# EAGLE design maskPlanC-PCB0 (EAGLE 9.6.2)
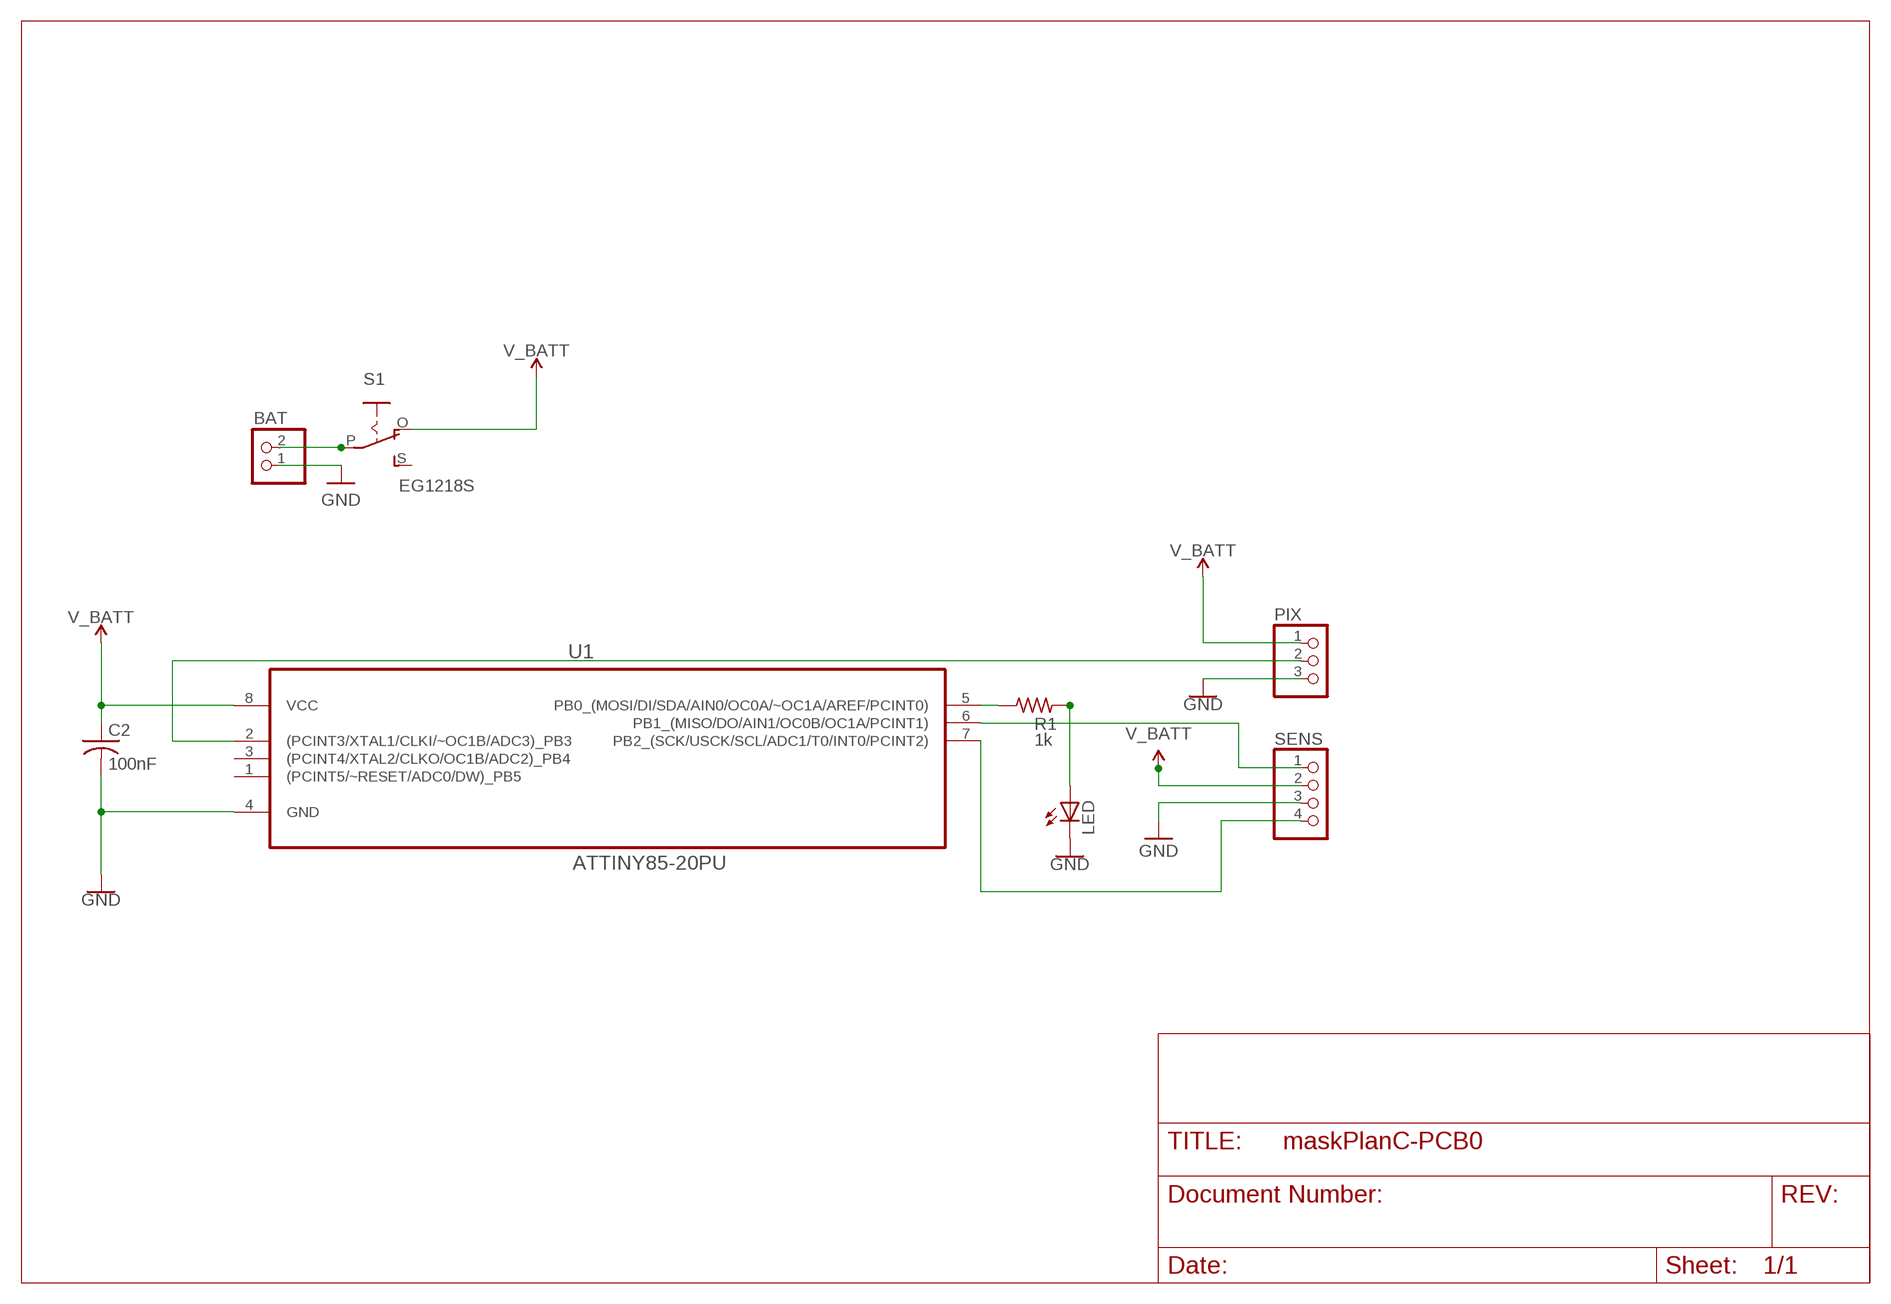
[diagram p0: schematic, sheet 1]

## Parts
BAT  PINHD-1X2  [1X02]
C2  100nF  C-US050-025X075  [C050-025X075]
LED  LED5MM  [LED5MM]
PIX  PINHD-1X3  [1X03]
R1  1k  R-US_0204/7  [0204/7]
S1  EG1218S  [EG1218]
SENS  PINHD-1X4  [1X04]
U1  ATTINY85-20PU  [DIP254P762X533-8]

## Nets
GND: BAT.1 C2.2 LED.K(C) PIX.3 SENS.3 U1.4(GND)
N$1: SENS.1 U1.6(PB1_(MISO/DO/AIN1/OC0B/OC1A/PCINT1))
N$2: LED.A R1.2
N$3: BAT.2 S1.P
N$5: PIX.2 U1.2((PCINT3/XTAL1/CLKI/~OC1B/ADC3)_PB3)
N$6: R1.1 U1.5(PB0_(MOSI/DI/SDA/AIN0/OC0A/~OC1A/AREF/PCINT0))
N$7: SENS.4 U1.7(PB2_(SCK/USCK/SCL/ADC1/T0/INT0/PCINT2))
V_BATT: C2.1 PIX.1 S1.O SENS.2 U1.8(VCC)
Unconnected: S1.S U1.1((PCINT5/~RESET/ADC0/DW)_PB5) U1.3((PCINT4/XTAL2/CLKO/OC1B/ADC2)_PB4)

## Library data of the parts
BAT = pinhead:PINHD-1X2: PIN HEADER
C2 = adafruit:C-US: CAPACITOR, American symbol
LED = adafruit:LED: LED OSRAM: - CHIPLED LG R971, LG N971, LY N971, LG Q971, LY Q971, LO R971, LY R971 LH N974, LH R974 LS Q976, LO Q976, LY Q976 LO Q996 - Hyper CHIPLED LW Q18S LB Q993, LB Q99A, LB R99A - SideLED LS A670, LO A670, LY A670, LG A670, LP A670 LB A673, LV A673, LT A673, LW A673 LH A674 LY A675 LS A676, LA A676, LO A676, LY A676, LW A676 LS A679, LY A679, LG A679 - Hyper Micro SIDELED® LS Y876, LA Y876, LO Y876, LY Y876 LT Y87S - SmartLED LW L88C, LW L88S LB L89C, LB L89S, LG L890 LS L89K, LO L89K, LY L89K LS L896, LA L896, LO L896, LY L896 - TOPLED LS T670, LO T670, LY T670, LG T670, LP T670 LSG T670, LSP T670, LSY T670, LOP T670, LYG T670 LG T671, LOG T671, LSG T671 LB T673, LV T673, LT T673, LW T673 LH T674 LS T676, LA T676, LO T676, LY T676, LB T676, LH T676, LSB T676, LW T676 LB T67C, LV T67C, LT T67C, LS T67K, LO T67K, LY T67K, LW E67C LS E67B, LA E67B, LO E67B, LY E67B, LB E67C, LV E67C, LT E67C LW T67C LS T679, LY T679, LG T679 LS T770, LO T770, LY T770, LG T770, LP T770 LB T773, LV T773, LT T773, LW T773 LH T774 LS E675, LA E675, LY E675, LS T675 LS T776, LA T776, LO T776, LY T776, LB T776 LHGB T686 LT T68C, LB T68C - Hyper Mini TOPLED® LB M676 - Mini TOPLED Santana® LG M470 LS M47K, LO M47K, LY M47K Source: http://www.osram.convergy.de/
PIX = pinhead:PINHD-1X3: PIN HEADER
R1 = adafruit:R-US_: RESISTOR, American symbol
S1 = EG1218:EG1218: SLIDING SWITCH 0.1" spacing through hole, vertical SPDT slide switch http://www.ladyada.net/library/pcb/eaglelibrary.html Check prices <https://pricing.snapeda.com/parts/EG1218/E-Switch/view-part?ref=eda>; AVAILABILITY: Warning; DESCRIPTION: Slide Switch SPDT Through Hole; MF: E-Switch; MP: EG1218; PACKAGE: Custom package E-Switch; PRICE: None; PURCHASE-URL: https://pricing.snapeda.com/search/part/EG1218/?ref=eda
SENS = pinhead:PINHD-1X4: PIN HEADER
U1 = ATTINY85-20PU:ATTINY85-20PU: 8-bit Microcontroller with In-System Programmable Flash; AVAILABILITY: Unavailable; DESCRIPTION: ATtiny Series 20 MHz 8 KB Flash 512 B SRAM 8-Bit Microcontroller - DIP-8; MF: Microchip; MP: ATTINY85-20PU; PACKAGE: DIP-8 Microchip; PRICE: None

## Board
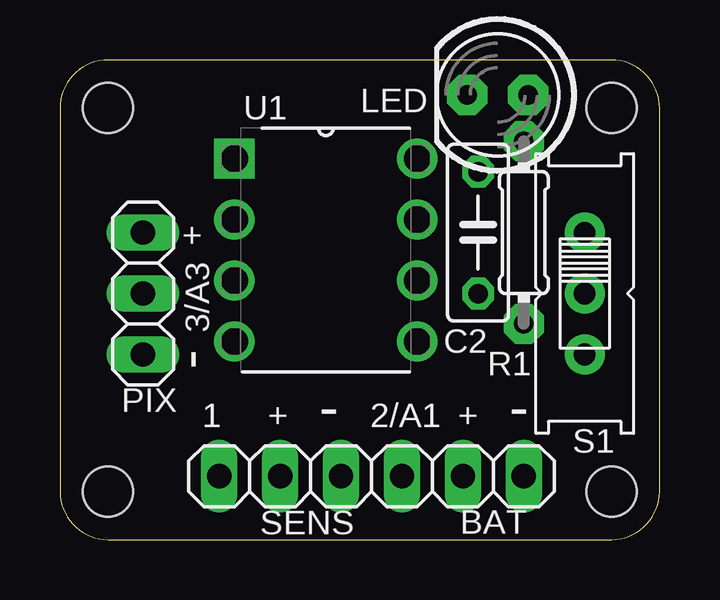
[diagram p1: board, top side]
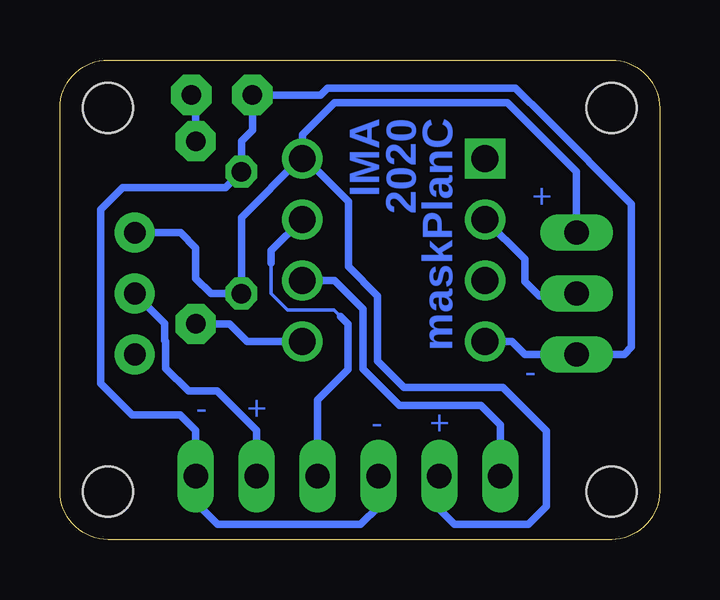
[diagram p2: board, bottom side, seen from below]

Size 25 x 20 mm. Coordinates in mm from the lower left corner, seen from the top.
Outline: 2,0 23,0 arc90 25,2 25,18 arc90 23,20 2,20 arc90 0,18 0,2 arc90 2,0
Copper layers (1*16): Top 0.035mm / dielectric 1.5mm / Bottom 0.035mm
Design rules "default *": minimum track width 6mil, minimum drill 0.7mm, track to track 12mil, track to pad 12mil, pad to pad 12mil, via to via 12mil, smd to smd 6mil, copper to edge 40mil, drill to drill 12mil, minimum pad ring 10mil, minimum via ring 8mil, stop-mask expansion 4mil, vias tented up to drill 0mil, thermal gap 10mil
Holes 2.1 mm at 2,2 23,2 23,18 2,18

### Footprints (pad centres in the part's own frame; a part is rotated, then mirrored left to right if it is on the bottom)
1X02 = drill 1.016 long: 1 -1.27,0; 2 1.27,0
C050-025X075 = drill 0.813 octagon: 1 -2.54,0; 2 2.54,0
LED5MM = drill 0.813 pad 1.676 octagon: A -1.27,0; K 1.27,0
1X03 = drill 1.016 long: 1 -2.54,0; 2 0,0; 3 2.54,0
0204/7 = drill 0.813 pad 1.676 octagon: 1 -3.81,0; 2 3.81,0
EG1218 = drill 0.9 pad 1.676: O -2.54,0; P 0,0; S 2.54,0
1X04 = drill 1.016 long: 1 -3.81,0; 2 -1.27,0; 3 1.27,0; 4 3.81,0
DIP254P762X533-8 = drill 1.118 square: 1 -7.62,7.62 | drill 1.118: 2 -7.62,5.08; 3 -7.62,2.54; 4 -7.62,0; 5 0,0; 6 0,2.54; 7 0,5.08; 8 0,7.62

### Placement (x,y rotation side)
BAT  18.07,2.64 180 top
C2  17.44,12.8 90 top
LED  18.25,18.54 180 top
PIX  3.47,10.26 270 top
R1  19.34,12.8 90 top
S1  21.88,10.26 270 top
SENS  10.45,2.64 0 top
U1  14.9,8.26 0 top

### Tracks (layer width: path | path; a pad name or v marks a point on that pad's centre or on a via)
GND
  Bottom 0.305: SENS.3 11.72,1.37 12.46,0.63 18.43,0.63 19.34,1.54 BAT.1 19.34,4.55 20,5.2 22,5.2 23.3,6.5 23.3,13.76 22.39,14.67 18.1,14.67 C2.2 17.44,16.61 16.98,17.07 LED.K 14.15,18.54 13.85,18.83 6.01,18.83 4.72,17.55 1.17,13.99 1.17,13.82 1.17,12.6 1.17,8.02 1.47,7.72 PIX.3 5.62,7.72 6.16,8.26 U1.4
N$1
  Bottom 0.305: U1.6 13.55,10.8 12.36,9.62 12.36,7.11 10.84,5.59 7.45,5.59 6.64,4.77 SENS.1
N$2
  Bottom 0.305: LED.A 19.34,18.36 R1.2
N$3
  Bottom 0.305: BAT.2 16.8,4.55 18.45,6.2 19.65,6.2 20.59,7.14 20.59,8.26 20.63,8.31 20.63,8.63 20.63,9.02 S1.P
N$5
  Bottom 0.305: PIX.2 3.57,10.16 5.01,10.16 5.62,10.77 5.62,11.69 U1.2
N$6
  Bottom 0.305: U1.5 17.21,8.26 17.94,8.99 R1.1
N$7
  Bottom 0.152: 13.31,9.31 13.58,9.58 15.51,9.58 16.19,10.26 16.19,11.53
  Bottom 0.305: SENS.4 14.26,5.81 12.99,7.09 12.99,8.99 13.31,9.31 | U1.7 16.19,12.05 16.19,11.53
V_BATT
  Bottom 0.305: SENS.2 9.18,1.26 8.55,0.63 5.48,0.63 4.72,1.39 4.72,4.53 6.54,6.35 10.65,6.35 11.76,7.45 11.76,10.16 12.97,11.38 12.97,14.09 14.77,15.88 U1.8 | U1.8 14.99,15.88 17.44,13.44 C2.1 18.7,10.26 19.34,10.9 19.34,12.16 19.98,12.8 S1.O | U1.8 14.9,16.88 13.55,18.22 6.35,18.22 3.47,15.34 PIX.1

### Text on the board
Bottom: maskPlanC | 2020 | IMA | + | - | + | - | + | -
tNames: + | 3/A3 | - | 1 | + | - | 2/A1 | + | -